# Altium schematic sheet Sound.SchDoc
size A
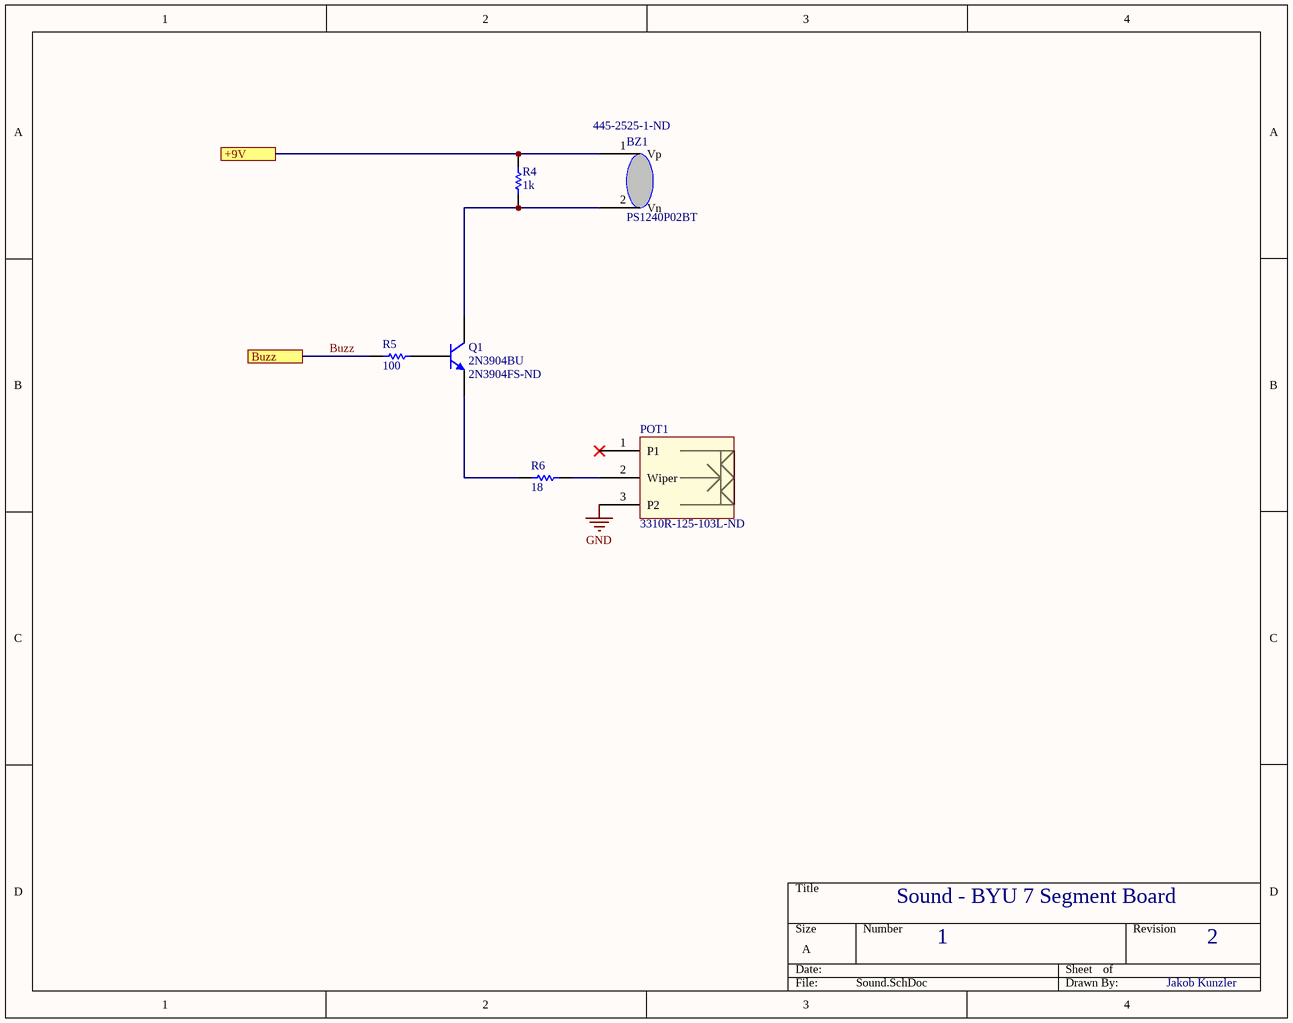
[diagram p0: Sound.SchDoc]

## Parts
BZ1  PS1240P02BT  Supplier Part Number 1: 445-2525-1-ND  [PS1240P02BT]
POT1  Supplier Part Number 1: 3310R-125-103L-ND  [3310R-001]  (hidden comment: 3310R-125-103L)
Q1  2N3904BU  Supplier Part Number 1: 2N3904FS-ND  [2N3904]
R4  1k  [Resistor Through Hole]
R5  100  [Resistor Through Hole]
R6  18  [Resistor Through Hole]

## Ports
+9V, Buzz

## Nets
GND: POT1.3(P2)
+9V: BZ1.1(Vp) R4.1 ; port +9V
Buzz: R5.2 ; port Buzz
NetBZ1_2: BZ1.2(Vn) Q1.3(C) R4.2
NetPOT1_2: POT1.2(Wiper) R6.1
NetQ1_1: Q1.1(E) R6.2
NetQ1_2: Q1.2(B) R5.1

Not connected (* = marked no-connect by the designer): POT1 1(P1)*

## Notes on the sheet
- Sound - BYU 7 Segment Board
- 1
- 2
- Jakob Kunzler

## Library data of the parts
BZ1 = PS12: Piezo Buzzer, Through Hole; ComponentLink1Description: 445-2525-1-ND; ComponentLink1URL: https://www.digikey.com/product-detail/en/tdk-corporation/PS1240P02BT/445-2525-1-ND/935930; Supplier 1: Digi-Key
POT1 = Potentiometer - 10k: POT 10K OHM 1/4W PLASTIC LINEAR; ComponentLink1Description: 3310R-125-103L-ND; ComponentLink1URL: https://www.digikey.com/product-detail/en/bourns-inc/3310R-125-103L/3310R-125-103L-ND/2537840; Supplier 1: Digi-Key
Q1 = 2N3904: TRANS NPN 40V 0.2A TO-92; Published: 8-Jun-2000; LatestRevisionDate: 15-Jan-2003; LatestRevisionNote: PCB Footprint 'BCY-W3/D4.7' replaced; DatasheetVersion: 1997; PackageVersion: Sep-1998; PackageReference: TO-92A; Publisher: Altium Limited; PackageDescription: TO, Flat Index; 3 In-Line, Axial Leads; Body Dia. 4.5mm; Leads 0.51 x 0.48 mm (max); ComponentLink1Description: Manufacturer Link; ComponentLink1URL: http://www.fairchildsemi.com/; ComponentLink2Description: Datasheet; ComponentLink2URL: http://www.fairchildsemi.com/ds/2N%2F2N3904.pdf; Supplier 1: Digi-Key; ComponentLink3Description: 2N3904FS-ND; ComponentLink3URL: https://www.digikey.com/product-detail/en/on-semiconductor/2N3904BU/2N3904FS-ND/1413
R4 = Resistor_1k: CF14JT1K00; Supplier 1: Digi-Key; ComponentLink1Description: CF14JT1K00TR-ND; ComponentLink1URL: https://www.digikey.com/product-detail/en/stackpole-electronics-inc/CF14JT1K00/CF14JT1K00TR-ND/1741314
R5 = Resistor_100: CF14JT100R; ComponentLink1Description: CF14JT100RCT-ND; ComponentLink1URL: https://www.digikey.com/product-detail/en/stackpole-electronics-inc/CF14JT100R/CF14JT100RCT-ND/1830327; Supplier 1: Digi-Key
R6 = Resistor_18: CF14JT18R0; Supplier 1: Digi-Key